# EAGLE design Board 1 (EAGLE 9.1.1)
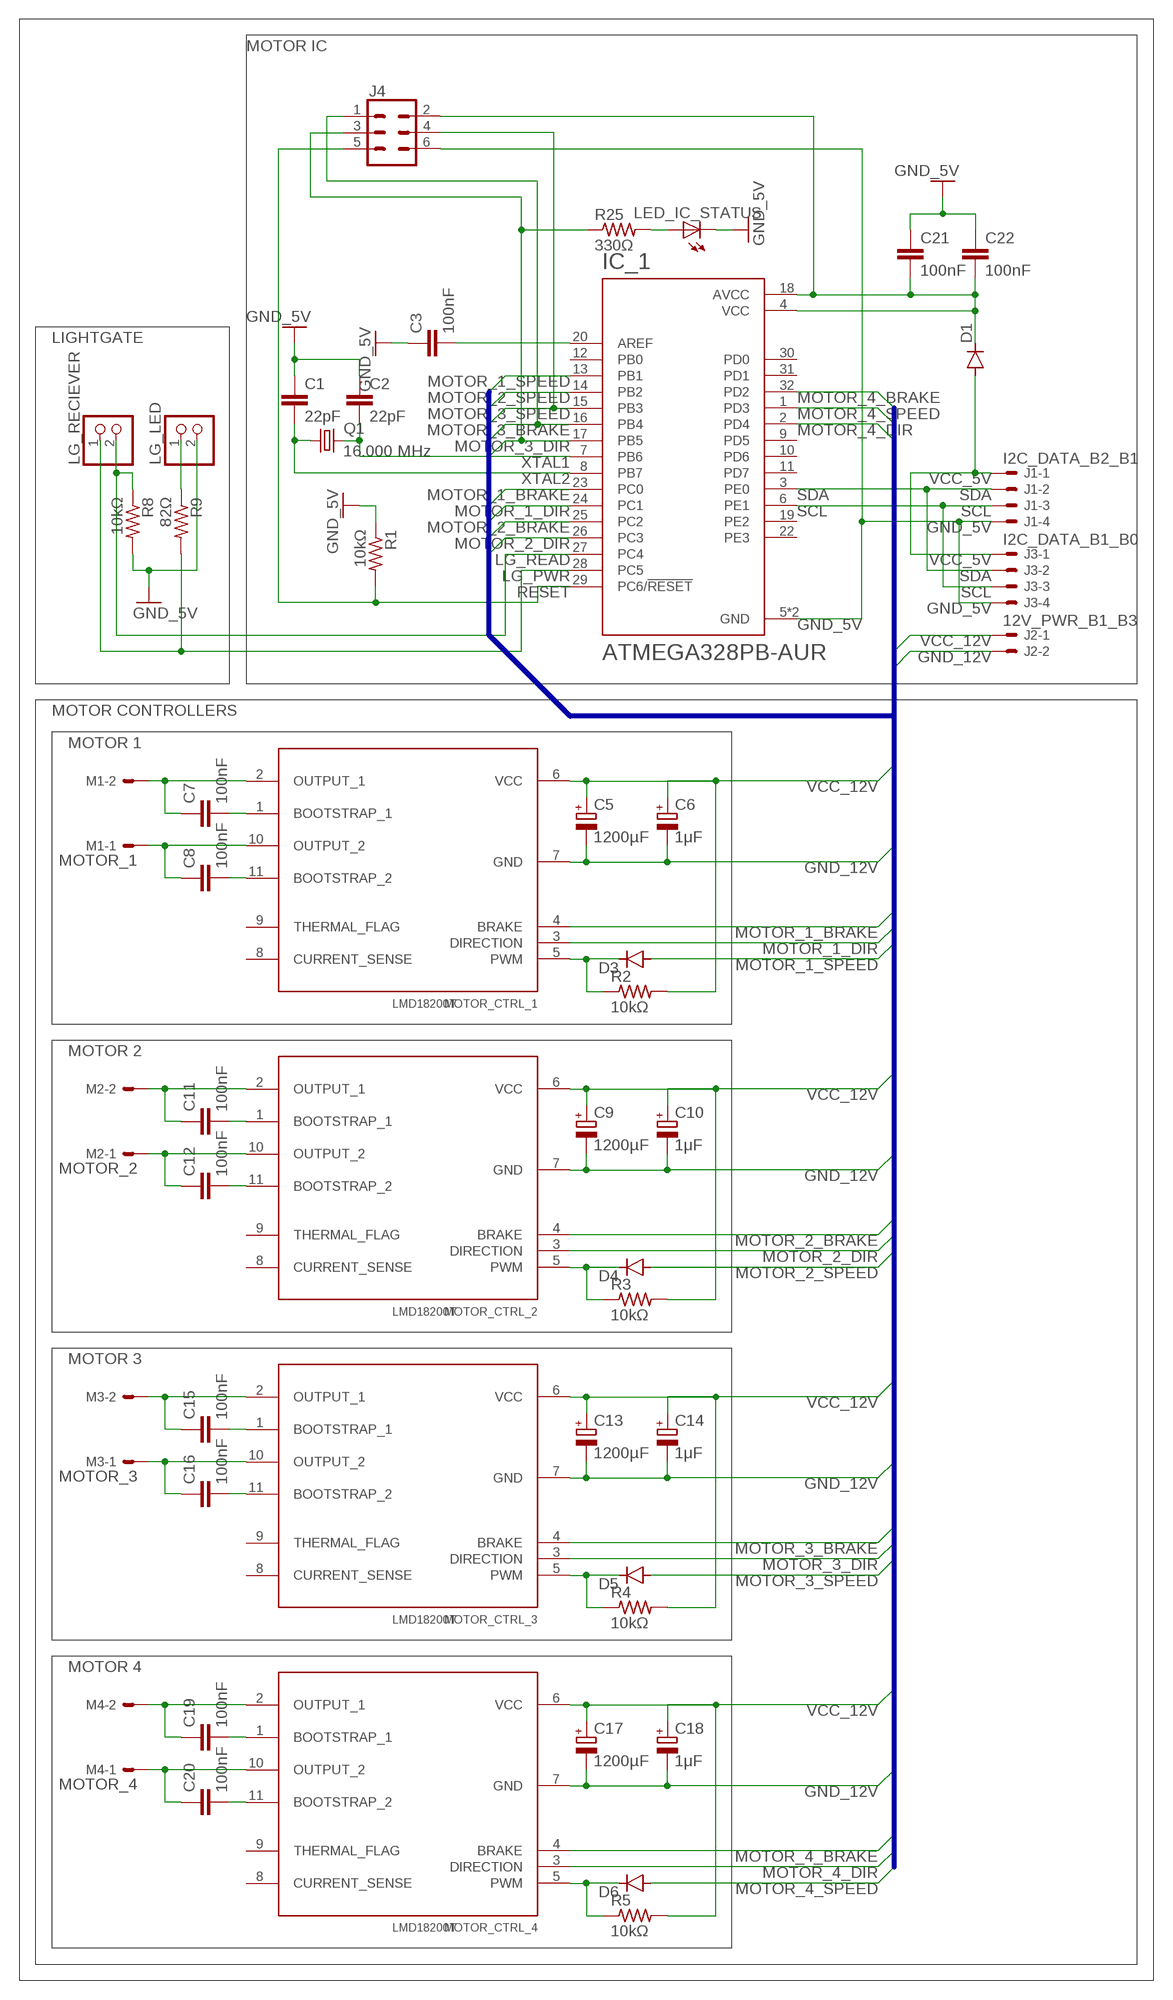
[diagram p0: schematic, sheet 1]

## Parts
C1  22pF  C-EU050-024X044  [C050-024X044]
C2  22pF  C-EU050-024X044  [C050-024X044]
C3  100nF  C-EU050-024X044  [C050-024X044]
C5  1200µF  CPOL-EUE5-13  [E5-13]
C6  1μF  CPOL-EUE2-5  [E2-5]
C7  100nF  C-EU050-024X044  [C050-024X044]
C8  100nF  C-EU050-024X044  [C050-024X044]
C9  1200µF  CPOL-EUE5-13  [E5-13]
C10  1μF  CPOL-EUE2-5  [E2-5]
C11  100nF  C-EU050-024X044  [C050-024X044]
C12  100nF  C-EU050-024X044  [C050-024X044]
C13  1200µF  CPOL-EUE5-13  [E5-13]
C14  1μF  CPOL-EUE2-5  [E2-5]
C15  100nF  C-EU050-024X044  [C050-024X044]
C16  100nF  C-EU050-024X044  [C050-024X044]
C17  1200µF  CPOL-EUE5-13  [E5-13]
C18  1μF  CPOL-EUE2-5  [E2-5]
C19  100nF  C-EU050-024X044  [C050-024X044]
C20  100nF  C-EU050-024X044  [C050-024X044]
C21  100nF  C-EU050-024X044  [C050-024X044]
C22  100nF  C-EU050-024X044  [C050-024X044]
D1  1N4148DO35-7  [DO35-7]
D3  1N4148DO35-7  [DO35-7]
D4  1N4148DO35-7  [DO35-7]
D5  1N4148DO35-7  [DO35-7]
D6  1N4148DO35-7  [DO35-7]
IC_1  ATMEGA328PB-AUR  [QFP80P900X900X120-32N]
J1  I2C_DATA_B2_B1  22-27-2041-04  [6410-04]
J2  12V_PWR_B1_B3  22-27-2021-02  [6410-02]
J3  I2C_DATA_B1_B0  22-27-2041-04  [6410-04]
J4  CONN_03X2SHROUD  [2X3-SHROUDED]
LED_IC_STATUS  LEDP-LCC-2  [P-LCC-2]
LG_LED  PINHD-1X2  [1X02]
LG_RECIEVER  PINHD-1X2  [1X02]
M1  MOTOR_1  22-27-2021-02  [6410-02]
M2  MOTOR_2  22-27-2021-02  [6410-02]
M3  MOTOR_3  22-27-2021-02  [6410-02]
M4  MOTOR_4  22-27-2021-02  [6410-02]
MOTOR_CTRL_1  LMD18200T  [TO-220-11]
MOTOR_CTRL_2  LMD18200T  [TO-220-11]
MOTOR_CTRL_3  LMD18200T  [TO-220-11]
MOTOR_CTRL_4  LMD18200T  [TO-220-11]
Q1  16.000 MHz  CRYSTALHC49U-V  [HC49U-V]
R1  10kΩ  R-US_0207/10  [0207/10]
R2  10kΩ  R-US_0207/10  [0207/10]
R3  10kΩ  R-US_0207/10  [0207/10]
R4  10kΩ  R-US_0207/10  [0207/10]
R5  10kΩ  R-US_0207/10  [0207/10]
R8  10kΩ  R-US_0207/10  [0207/10]
R9  82Ω  R-US_0207/10  [0207/10]
R25  330Ω  R-US_0207/10  [0207/10]

## Nets
GND_5V [+5V Power]: C1.1 C2.1 C3.1 C21.1 C22.1 IC_1.5(GND) IC_1.21(GND) J1.4 J3.4 J4.6 LED_IC_STATUS.C LG_LED.2 R1.1 R8.2
GND_12V [+12V Power]: C5.- C6.- C9.- C10.- C13.- C14.- C17.- C18.- J2.2 MOTOR_CTRL_1.7(GND) MOTOR_CTRL_2.7(GND) MOTOR_CTRL_3.7(GND) MOTOR_CTRL_4.7(GND)
LG_PWR: IC_1.28(PC5) LG_RECIEVER.1 R9.2
LG_READ: IC_1.27(PC4) LG_RECIEVER.2 R8.1
MOTOR_1_BRAKE: IC_1.23(PC0) MOTOR_CTRL_1.4(BRAKE)
MOTOR_1_DIR: IC_1.24(PC1) MOTOR_CTRL_1.3(DIRECTION)
MOTOR_1_SPEED: D3.A IC_1.13(PB1)
MOTOR_2_BRAKE: IC_1.25(PC2) MOTOR_CTRL_2.4(BRAKE)
MOTOR_2_DIR: IC_1.26(PC3) MOTOR_CTRL_2.3(DIRECTION)
MOTOR_2_SPEED: D4.A IC_1.14(PB2)
MOTOR_3_BRAKE: IC_1.16(PB4) J4.1 MOTOR_CTRL_3.4(BRAKE)
MOTOR_3_DIR: IC_1.17(PB5) J4.3 MOTOR_CTRL_3.3(DIRECTION) R25.1
MOTOR_3_SPEED: D5.A IC_1.15(PB3) J4.4
MOTOR_4_BRAKE: IC_1.32(PD2) MOTOR_CTRL_4.4(BRAKE)
MOTOR_4_DIR: IC_1.2(PD4) MOTOR_CTRL_4.3(DIRECTION)
MOTOR_4_SPEED: D6.A IC_1.1(PD3)
N$1: C3.2 IC_1.20(AREF)
N$4: LG_LED.1 R9.1
N$6: LED_IC_STATUS.A R25.2
N$8: D3.C MOTOR_CTRL_1.5(PWM) R2.1
N$10 [+5V Power]: C7.1 M1.2 MOTOR_CTRL_1.2(OUTPUT_1)
N$11 [+5V Power]: C21.2 C22.2 D1.C IC_1.4(VCC) IC_1.18(AVCC) J4.2
N$12 [+5V Power]: C8.1 M1.1 MOTOR_CTRL_1.10(OUTPUT_2)
N$13 [+5V Power]: C8.2 MOTOR_CTRL_1.11(BOOTSTRAP_2)
N$14 [+5V Power]: C7.2 MOTOR_CTRL_1.1(BOOTSTRAP_1)
N$17: D4.C MOTOR_CTRL_2.5(PWM) R3.1
N$18 [+5V Power]: C11.1 M2.2 MOTOR_CTRL_2.2(OUTPUT_1)
N$19 [+5V Power]: C12.1 M2.1 MOTOR_CTRL_2.10(OUTPUT_2)
N$20 [+5V Power]: C12.2 MOTOR_CTRL_2.11(BOOTSTRAP_2)
N$21: C11.2 MOTOR_CTRL_2.1(BOOTSTRAP_1)
N$24: D5.C MOTOR_CTRL_3.5(PWM) R4.1
N$25 [+5V Power]: C15.1 M3.2 MOTOR_CTRL_3.2(OUTPUT_1)
N$26 [+5V Power]: C16.1 M3.1 MOTOR_CTRL_3.10(OUTPUT_2)
N$27 [+5V Power]: C16.2 MOTOR_CTRL_3.11(BOOTSTRAP_2)
N$28 [+5V Power]: C15.2 MOTOR_CTRL_3.1(BOOTSTRAP_1)
N$31: D6.C MOTOR_CTRL_4.5(PWM) R5.1
N$32 [+5V Power]: C19.1 M4.2 MOTOR_CTRL_4.2(OUTPUT_1)
N$33 [+5V Power]: C20.1 M4.1 MOTOR_CTRL_4.10(OUTPUT_2)
N$34 [+5V Power]: C20.2 MOTOR_CTRL_4.11(BOOTSTRAP_2)
N$35 [+5V Power]: C19.2 MOTOR_CTRL_4.1(BOOTSTRAP_1)
RESET: IC_1.29(PC6/!RESET) J4.5 R1.2
SCL: IC_1.6(PE1) J1.3 J3.3
SDA: IC_1.3(PE0) J1.2 J3.2
VCC_5V [+5V Power]: D1.A J1.1 J3.1
VCC_12V [+12V Power]: C5.+ C6.+ C9.+ C10.+ C13.+ C14.+ C17.+ C18.+ J2.1 MOTOR_CTRL_1.6(VCC) MOTOR_CTRL_2.6(VCC) MOTOR_CTRL_3.6(VCC) MOTOR_CTRL_4.6(VCC) R2.2 R3.2 R4.2 R5.2
XTAL1: C2.2 IC_1.7(PB6) Q1.2
XTAL2: C1.2 IC_1.8(PB7) Q1.1
Unconnected: IC_1.9(PD5) IC_1.10(PD6) IC_1.11(PD7) IC_1.12(PB0) IC_1.19(PE2) IC_1.22(PE3) IC_1.30(PD0) IC_1.31(PD1) MOTOR_CTRL_1.8(CURRENT_SENSE) MOTOR_CTRL_1.9(THERMAL_FLAG) MOTOR_CTRL_2.8(CURRENT_SENSE) MOTOR_CTRL_2.9(THERMAL_FLAG) MOTOR_CTRL_3.8(CURRENT_SENSE) MOTOR_CTRL_3.9(THERMAL_FLAG) MOTOR_CTRL_4.8(CURRENT_SENSE) MOTOR_CTRL_4.9(THERMAL_FLAG)

## Buses
MOTOR:GND_12V,MOTOR_1_BRAKE,MOTOR_1_DIR,MOTOR_1_SPEED,MOTOR_2_BRAKE,MOTOR_2_DIR,MOTOR_2_SPEED,MOTOR_3_BRAKE,MOTOR_3_DIR,MOTOR_3_SPEED,MOTOR_4_BRAKE,MOTOR_4_DIR,MOTOR_4_SPEED,VCC_12V

## Notes on the sheet
- MOTOR IC
- LIGHTGATE
- MOTOR CONTROLLERS
- MOTOR 1
- MOTOR 2
- MOTOR 3
- MOTOR 4

## Library data of the parts
C1-C3 C7 C8 C11 C12 C15 C16 C19-C22 = rcl:C-EU: CAPACITOR, European symbol; SPICEPREFIX: C
C5 C6 C9 C10 C13 C14 C17 C18 = rcl:CPOL-EU: POLARIZED CAPACITOR, European symbol; SPICEPREFIX: C
D1 D3-D6 = diode:1N4148: DIODE high speed (Philips)
IC_1 = ATMEGA328PB-AUR:ATMEGA328PB-AUR: ATmega Series 20 MHz 32 KB Flash 2 KB SRAM 8-Bit Microcontroller - TQFP-32; AVAILABILITY: Unavailable; DESCRIPTION: AVR microcontroller; EEPROM: 1024B; SRAM: 2kB; Flash: 32kB; TQFP32; MF: Microchip; MP: ATMEGA328PB-AUR; PACKAGE: TQFP-32 Microchip; PRICE: None
J1 J3 = con-molex:22-?-04: CONNECTOR wire to board 2.54 mm (.1 inch) pitch header; MF: MOLEX; OC_FARNELL: unknown; OC_NEWARK: unknown
J2 M1-M4 = con-molex:22-?-02: CONNECTOR wire to board 2.54 mm (.1 inch) pitch header; MF: MOLEX; OC_FARNELL: unknown; OC_NEWARK: unknown
J4 = SparkFun-Connectors:CONN_03X2: Multi connection point. Often used as Generic Header-pin footprint for 0.1 inch spaced/style header connections You can populate with any combo of single row headers, but if you'd like an exact match, check these: Header - 2x3 (Male, 0.1") <https://www.sparkfun.com/products/12807> (PRT-12807) Header - 2x3 (Female, 0.1") <https://www.sparkfun.com/products/13010> (PRT-13010) 2x3 Pin Shrouded Header <https://www.sparkfun.com/products/10877> (PRT-10877) On any of the 0.1 inch spaced packages, you can populate with these: Break Away Headers - Straight <https://www.sparkfun.com/products/116> (PRT-00116) Break Away Male Headers - Right Angle <https://www.sparkfun.com/products/553> (PRT-00553) Female Headers <https://www.sparkfun.com/products/115> (PRT-00115) Break Away Headers - Machine Pin <https://www.sparkfun.com/products/117> (PRT-00117) Break Away Female Headers - Swiss Machine Pin <https://www.sparkfun.com/products/743> (PRT-00743) Special note: the shrouded connector mates well with our 3x2 ribbon cables: Ribbon Crimp Connector - 6-pin (2x3, Female) <https://www.sparkfun.com/products/10651> (PRT-10651) Ribbon Cable - 6 wire (15ft) <https://www.sparkfun.com/products/10646> (PRT-10646); PROD_ID: CONN-10681; SF_ID: PRT_10877
LED_IC_STATUS = adafruit:LED: LED OSRAM: - CHIPLED LG R971, LG N971, LY N971, LG Q971, LY Q971, LO R971, LY R971 LH N974, LH R974 LS Q976, LO Q976, LY Q976 LO Q996 - Hyper CHIPLED LW Q18S LB Q993, LB Q99A, LB R99A - SideLED LS A670, LO A670, LY A670, LG A670, LP A670 LB A673, LV A673, LT A673, LW A673 LH A674 LY A675 LS A676, LA A676, LO A676, LY A676, LW A676 LS A679, LY A679, LG A679 - Hyper Micro SIDELED® LS Y876, LA Y876, LO Y876, LY Y876 LT Y87S - SmartLED LW L88C, LW L88S LB L89C, LB L89S, LG L890 LS L89K, LO L89K, LY L89K LS L896, LA L896, LO L896, LY L896 - TOPLED LS T670, LO T670, LY T670, LG T670, LP T670 LSG T670, LSP T670, LSY T670, LOP T670, LYG T670 LG T671, LOG T671, LSG T671 LB T673, LV T673, LT T673, LW T673 LH T674 LS T676, LA T676, LO T676, LY T676, LB T676, LH T676, LSB T676, LW T676 LB T67C, LV T67C, LT T67C, LS T67K, LO T67K, LY T67K, LW E67C LS E67B, LA E67B, LO E67B, LY E67B, LB E67C, LV E67C, LT E67C LW T67C LS T679, LY T679, LG T679 LS T770, LO T770, LY T770, LG T770, LP T770 LB T773, LV T773, LT T773, LW T773 LH T774 LS E675, LA E675, LY E675, LS T675 LS T776, LA T776, LO T776, LY T776, LB T776 LHGB T686 LT T68C, LB T68C - Hyper Mini TOPLED® LB M676 - Mini TOPLED Santana® LG M470 LS M47K, LO M47K, LY M47K Source: http://www.osram.convergy.de/
LG_LED LG_RECIEVER = pinhead:PINHD-1X2: PIN HEADER
MOTOR_CTRL_1-MOTOR_CTRL_4 = lmd1820x:LMD18200: National Semiconductor LMD18200 3A, 55V H-Bridge
Q1 = crystal:CRYSTAL: CRYSTAL; OC_FARNELL: 1666969; OC_NEWARK: unknown
R1-R5 R8 R9 R25 = resistor:R-US_: RESISTOR, American symbol

## Net classes
1 +12V Power: width 2.032 mm, drill 1.397 mm, clearance 0.356 mm
2 +5V Power: width 0.508 mm, drill 0.61 mm, clearance 0.203 mm

## Board
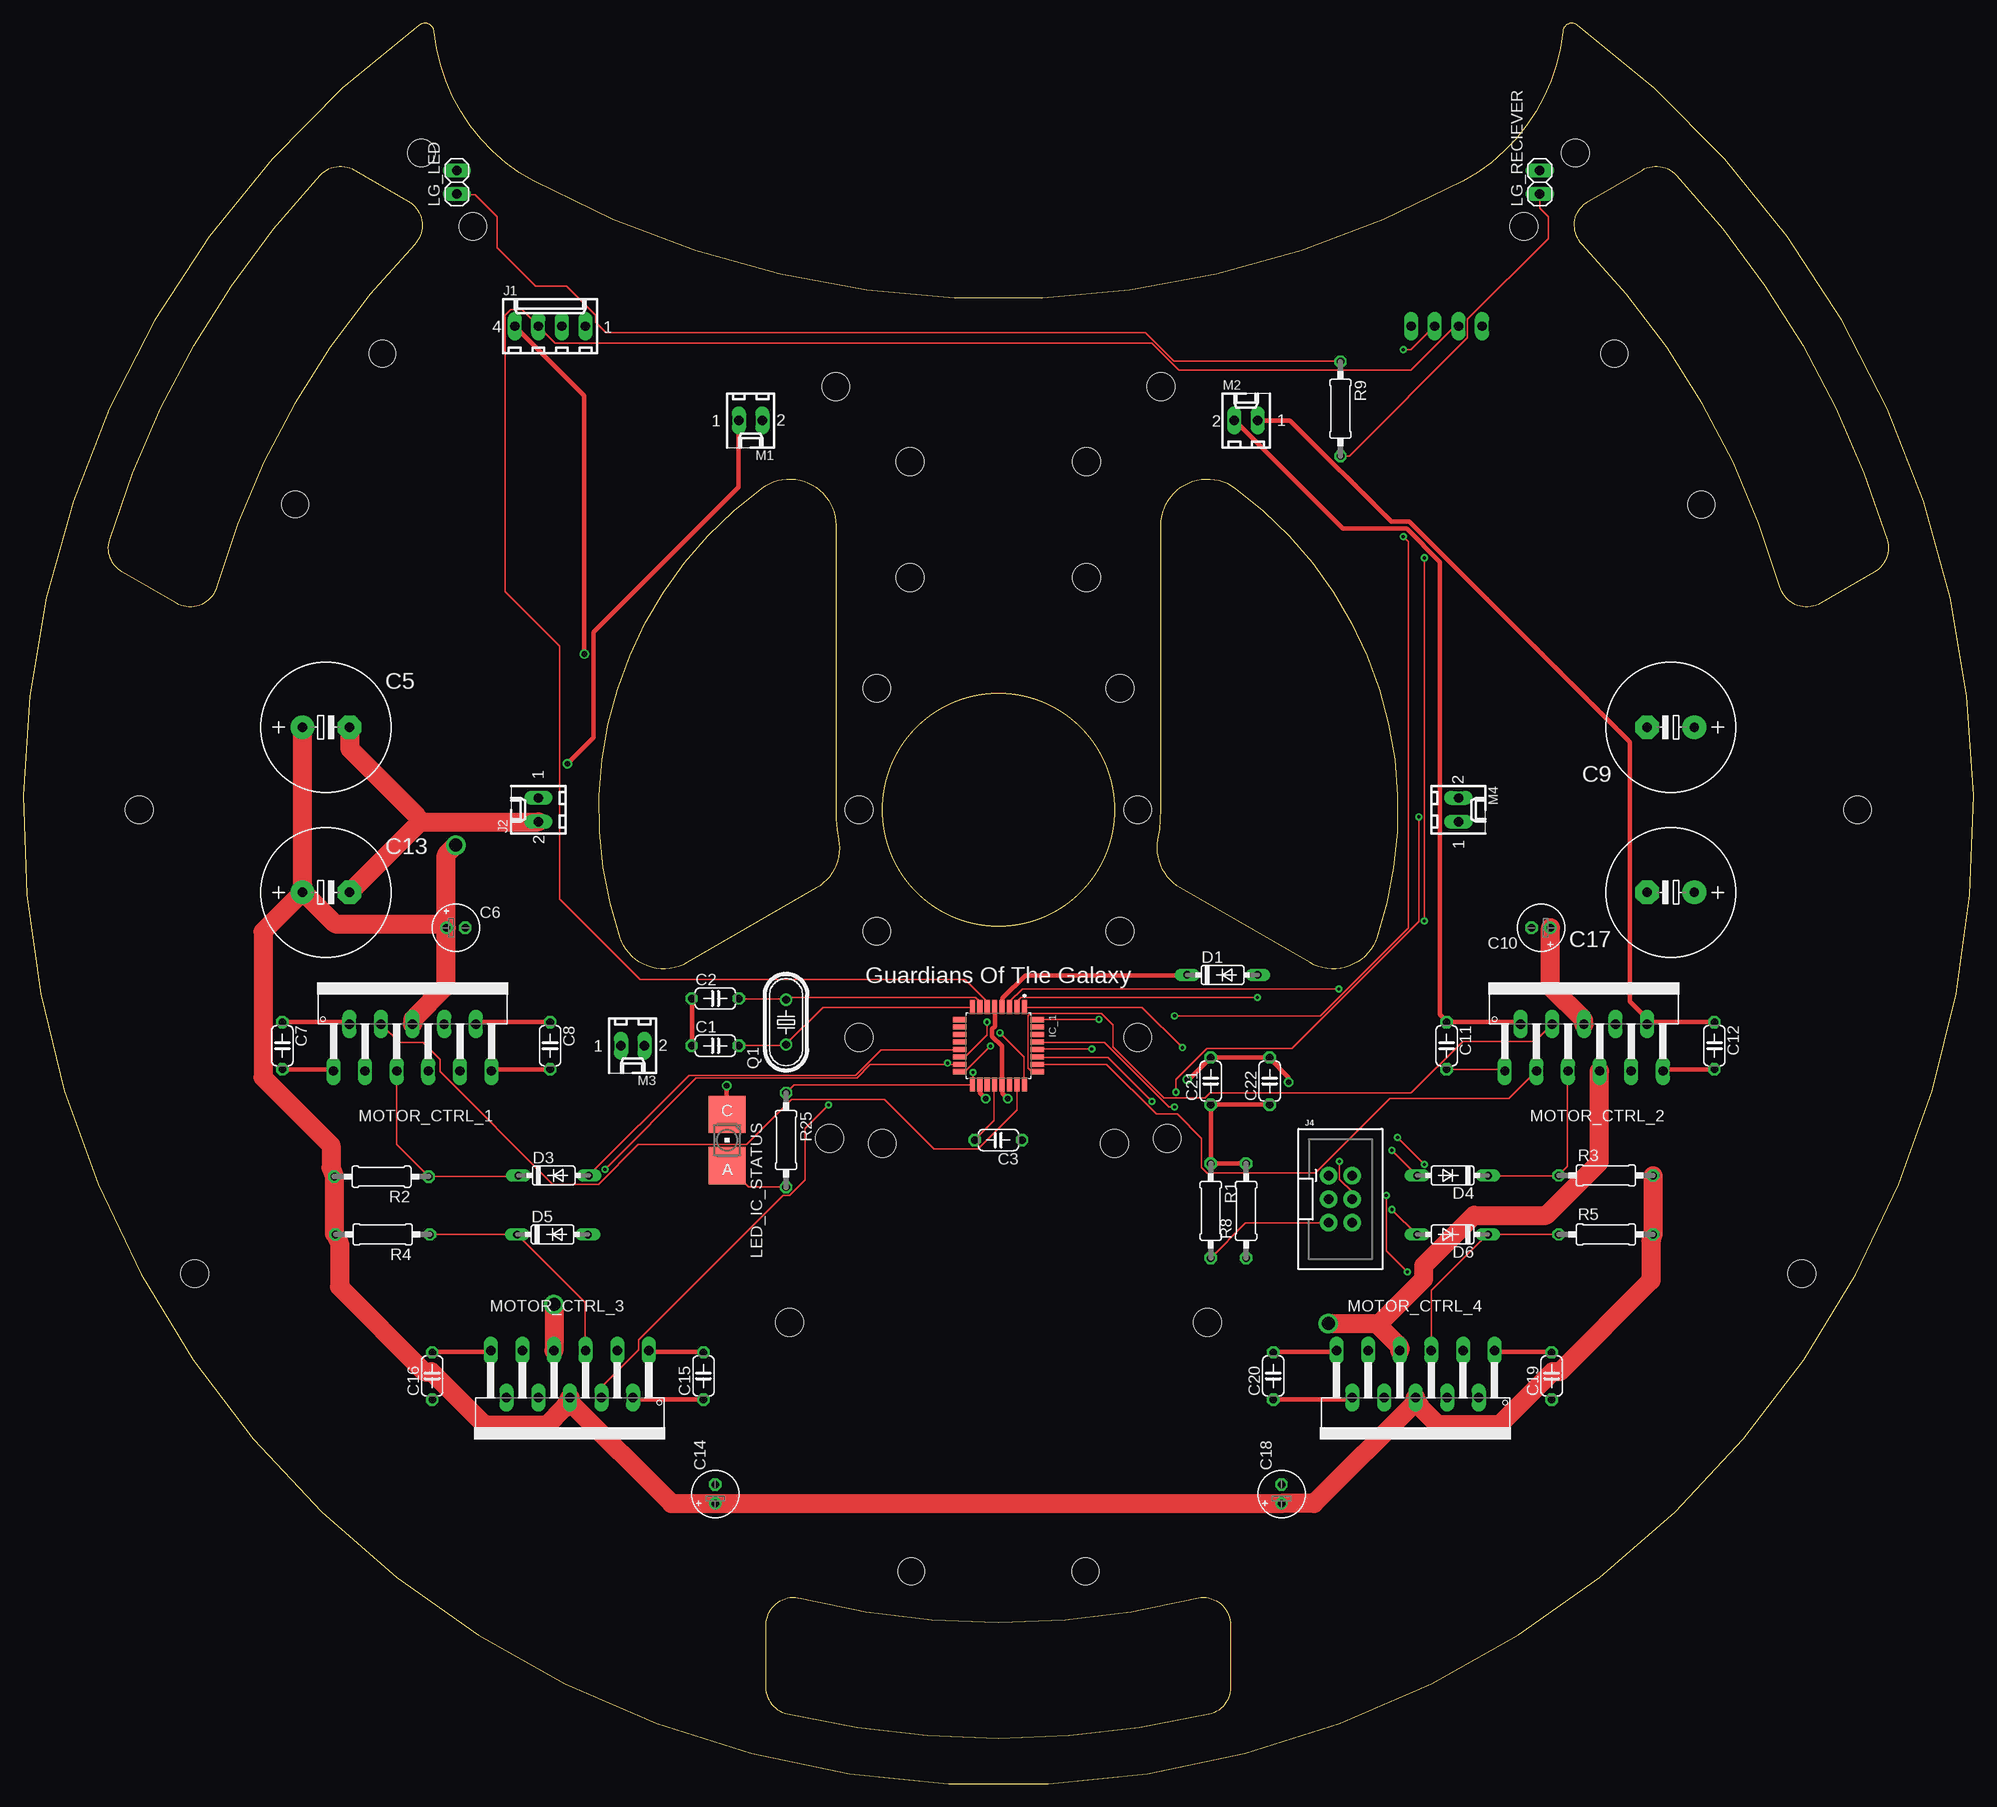
[diagram p1: board, top side]
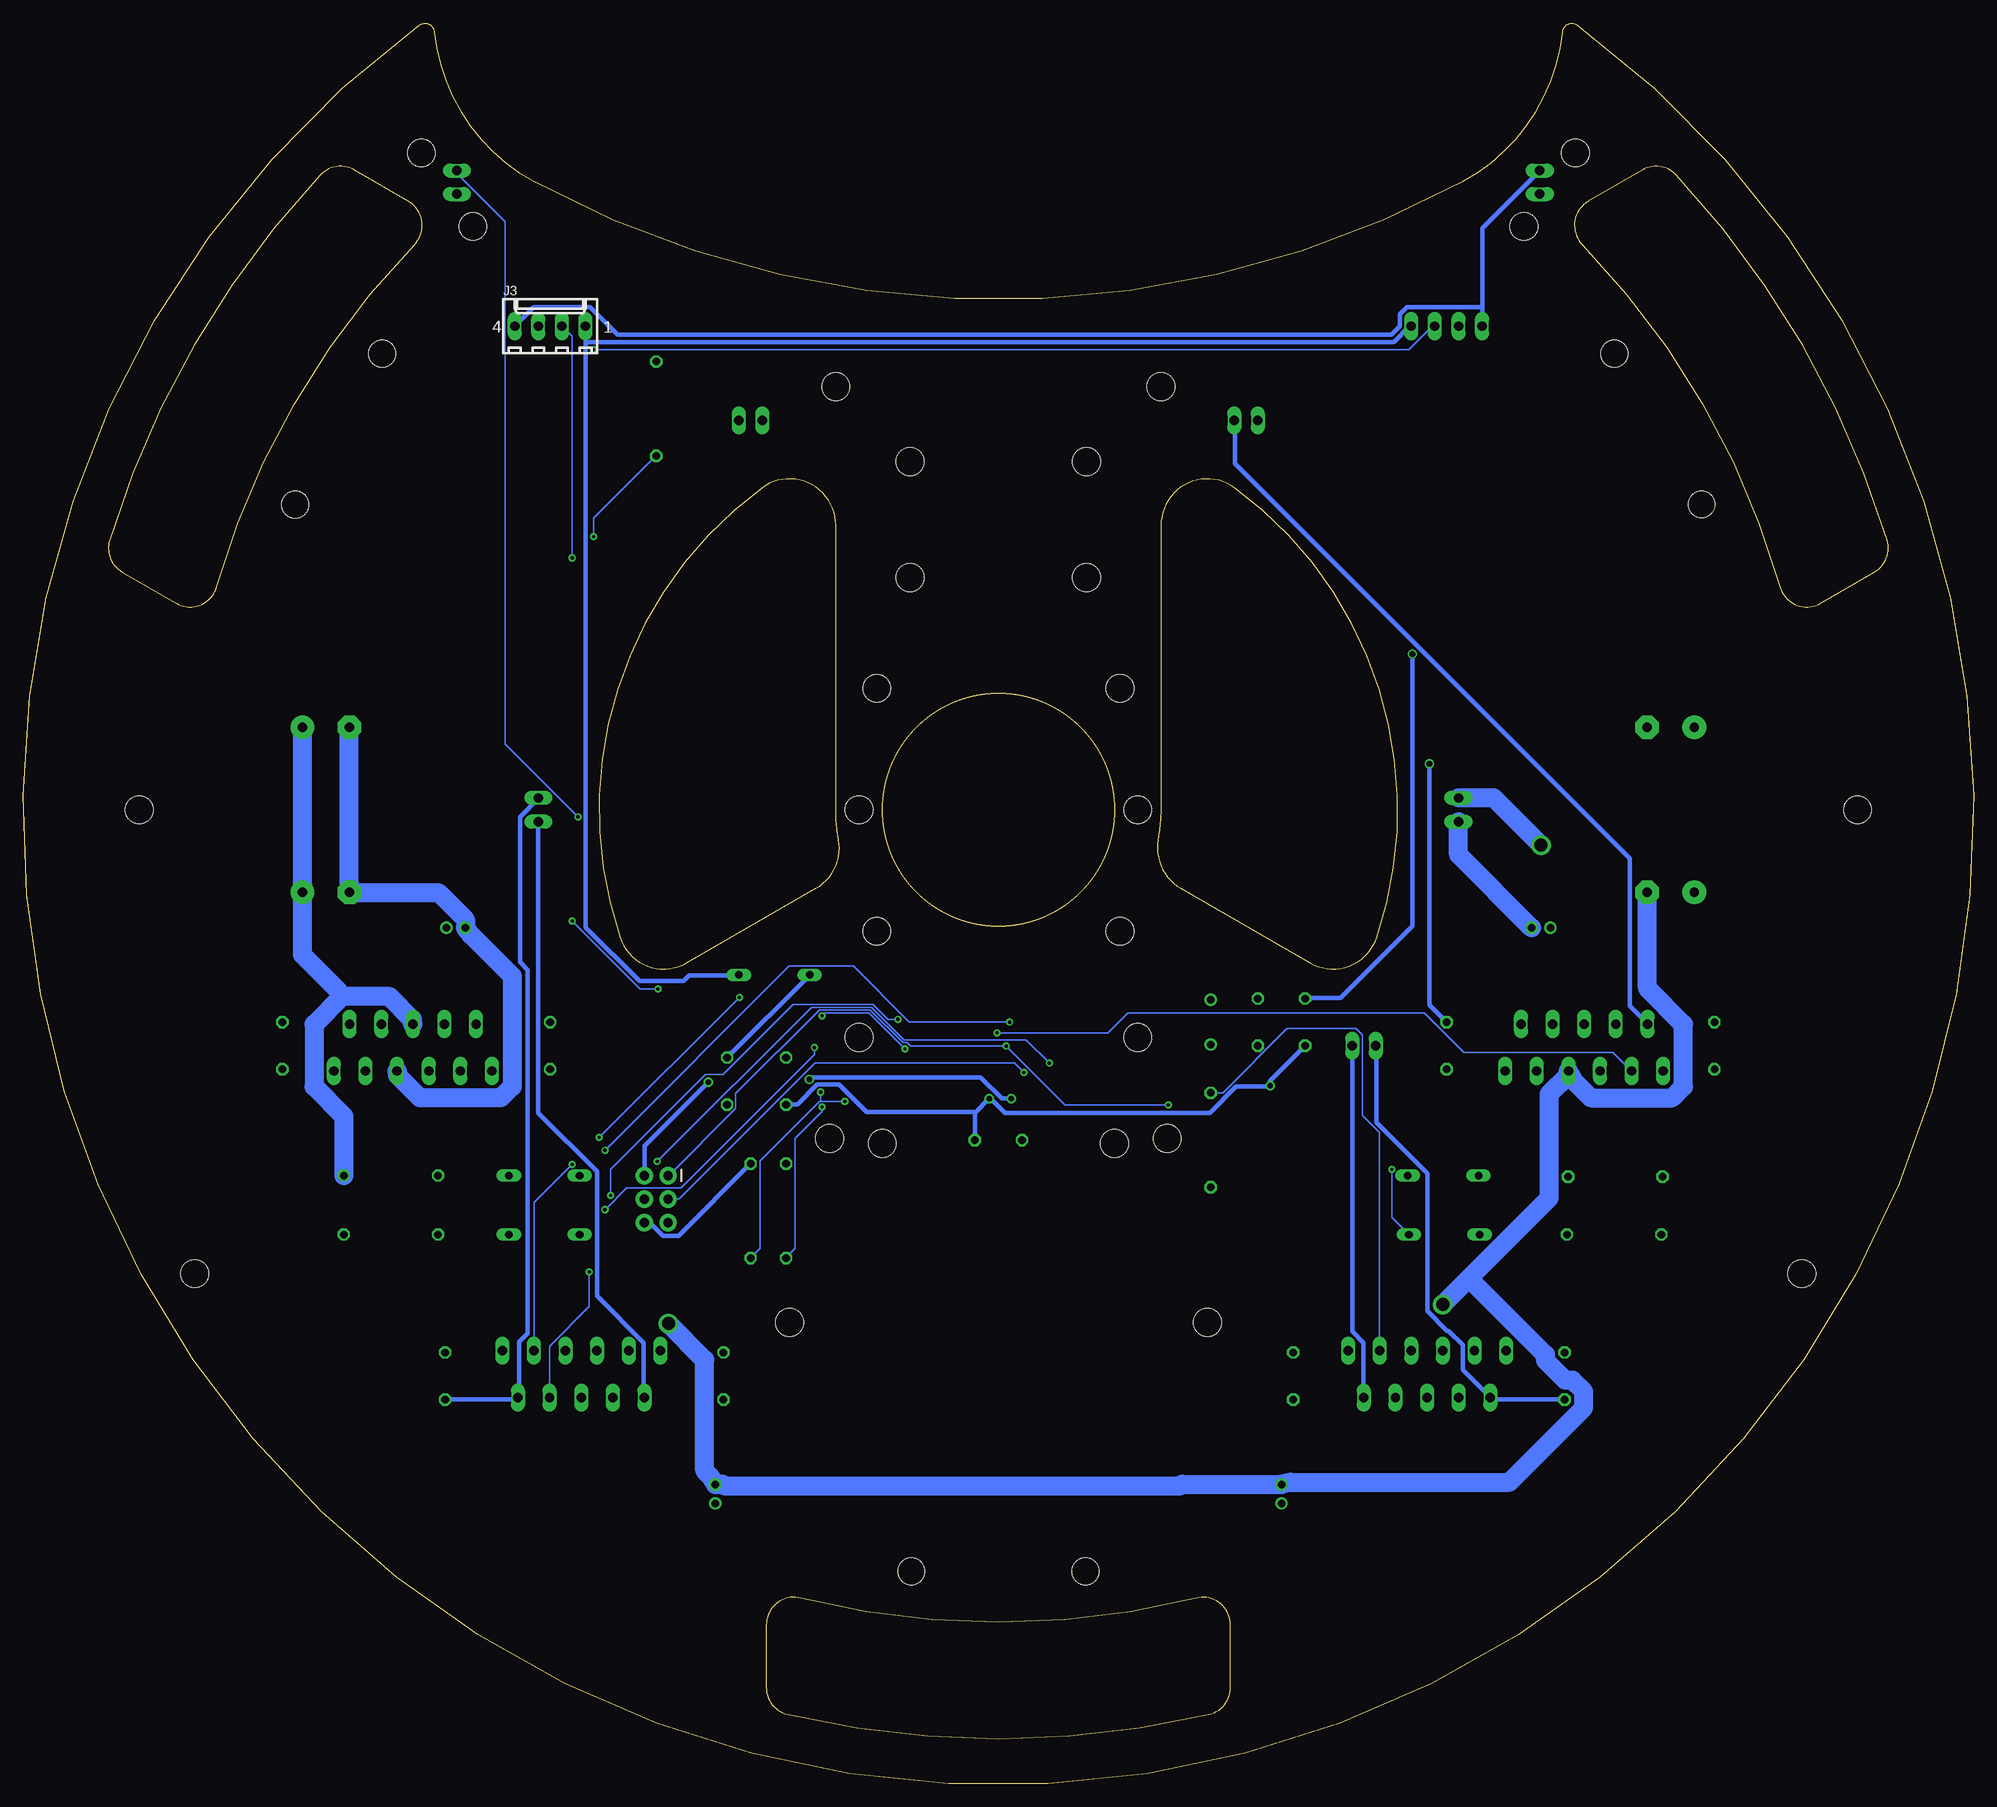
[diagram p2: board, bottom side, seen from below]

Size 209.98 x 189.55 mm. Coordinates in mm from the lower left corner, seen from the top.
Outline: 130.45,139.52 arc-72 145.74,91.13 arc-101 138.5,88.4 124.61,96.42 arc-71 122.2,101.66 arc11 122.49,104.86 122.49,135.49 arc-126 130.45,139.52
Outline: 85.37,96.42 71.48,88.4 arc-101 64.24,91.14 arc-72 79.53,139.52 arc-126 87.49,135.49 87.49,104.86 arc11 87.78,101.66 arc-71 85.37,96.42
Outline: 189.13,128.88 arc28 167.86,165.72 arc-104 168.51,170.4 174.3,173.75 arc-77 177.99,173.2 arc-26 200.68,133.92 arc-77 199.3,130.45 193.51,127.1 arc-104 189.13,128.88
Outline: 16.46,127.1 10.67,130.45 arc-77 9.3,133.92 arc-26 31.98,173.2 arc-77 35.67,173.75 41.46,170.4 arc-104 42.12,165.72 arc28 20.85,128.88 arc-104 16.46,127.1
Outline: 127.67,7.47 arc-26 82.31,7.47 arc-77 79.99,10.39 79.99,17.08 arc-104 83.72,19.99 arc28 126.26,19.99 arc-104 129.99,17.08 129.99,10.39 arc-77 127.67,7.47
Outline: 44.24,188.65 arc121 42.65,189.35 arc287 167.33,189.35 arc121 165.74,188.65 arc-56 154.99,172.53 arc-57 54.99,172.53 arc-56 44.24,188.65
Outline: circle at 104.99,104.86 radius 12.5
Copper layers (1*16): Top 0.035mm / dielectric 1.5mm / Bottom 0.035mm
Design rules "default": minimum track width 6mil, minimum drill 0.35mm, track to track 6mil, track to pad 6mil, pad to pad 6mil, via to via 6mil, smd to smd 6mil, copper to edge 40mil, drill to drill 6mil, minimum pad ring 10mil, minimum via ring 8mil, stop-mask expansion 4mil, vias tented up to drill 0mil, thermal gap 10mil
Holes 3 mm at 42.86,175.57 48.4,167.66 161.57,167.66 167.11,175.57 87.49,150.41 122.49,150.41 95.49,142.36 114.49,142.36 95.49,129.86 114.49,129.86 91.91,117.94 118.07,117.94 89.99,104.86 119.99,104.86 91.91,91.78 118.07,91.78 89.99,80.35 119.99,80.35 86.81,69.48 92.49,68.93 117.49,68.93 123.17,69.48 82.49,49.68 127.49,49.68 18.48,54.91 12.5,104.86 197.49,104.86 191.5,54.91
Holes 2.9 mm at 95.61,22.86 114.37,22.87 29.29,137.74 38.67,153.98 171.32,153.98 180.68,137.74
tRestrict: 44 lines
bRestrict: 44 lines

### Footprints (pad centres in the part's own frame; a part is rotated, then mirrored left to right if it is on the bottom)
C050-024X044 = drill 0.813 octagon: 1 -2.54,0; 2 2.54,0
E5-13 = drill 1.016 pad 2.54: + -2.54,0 | drill 1.016 pad 2.54 octagon: - 2.54,0
E2-5 = drill 0.813 pad 1.27: + -1.016,0 | drill 0.813 pad 1.27 octagon: - 1.016,0
DO35-7 = drill 0.813 long: A 3.81,0; C -3.81,0
QFP80P900X900X120-32N = smd 1.47 x 0.55: 1 -4.17,2.8; 2 -4.17,2; 3 -4.17,1.2; 4 -4.17,0.4; 5 -4.17,-0.4; 6 -4.17,-1.2; 7 -4.17,-2; 8 -4.17,-2.8; 17 4.17,-2.8; 18 4.17,-2; 19 4.17,-1.2; 20 4.17,-0.4; 21 4.17,0.4; 22 4.17,1.2; 23 4.17,2; 24 4.17,2.8 | smd 0.55 x 1.47: 9 -2.8,-4.17; 10 -2,-4.17; 11 -1.2,-4.17; 12 -0.4,-4.17; 13 0.4,-4.17; 14 1.2,-4.17; 15 2,-4.17; 16 2.8,-4.17; 25 2.8,4.17; 26 2,4.17; 27 1.2,4.17; 28 0.4,4.17; 29 -0.4,4.17; 30 -1.2,4.17; 31 -2,4.17; 32 -2.8,4.17
6410-04 = drill 1.016 long: 1 3.81,0; 2 1.27,0; 3 -1.27,0; 4 -3.81,0
6410-02 = drill 1.016 long: 1 1.27,0; 2 -1.27,0
2X3-SHROUDED = drill 1.016 pad 1.88: 1 -1.27,2.54; 2 1.27,2.54; 3 -1.27,0; 4 1.27,0; 5 -1.27,-2.54; 6 1.27,-2.54
P-LCC-2 = smd 4 x 4: A 0,2.75; C 0,-2.75
1X02 = drill 1.016 long: 1 -1.27,0; 2 1.27,0
TO-220-11 = drill 1.016 long: 1 -8.084,-2.718; 2 -6.382,2.337; 3 -4.68,-2.718; 4 -2.978,2.337; 5 -1.276,-2.718; 6 0.425,2.337; 7 2.127,-2.718; 8 3.829,2.337; 9 5.531,-2.718; 10 7.233,2.337; 11 8.934,-2.718
HC49U-V = drill 0.813: 1 -2.413,0; 2 2.413,0
0207/10 = drill 0.813 octagon: 1 -5.08,0; 2 5.08,0

### Placement (x,y rotation side)
C1  74.51,79.46 0 top
C2  74.51,84.54 0 top
C3  104.99,69.3 180 top
C5  32.6,113.75 0 top
C6  46.57,92.16 0 top
C7  27.9,79.46 270 top
C8  56.73,79.46 270 top
C9  177.38,113.75 180 top
C10  163.41,92.16 180 top
C11  153.25,79.46 270 top
C12  182.08,79.46 270 top
C13  32.6,95.97 0 top
C14  74.51,31.2 90 top
C15  73.24,43.9 90 top
C16  44.03,43.9 90 top
C17  177.38,95.97 180 top
C18  135.47,31.2 90 top
C19  164.55,43.9 90 top
C20  134.58,43.9 90 top
C21  127.85,75.65 90 top
C22  134.2,75.65 90 top
D1  129.12,87.08 0 top
D3  57.11,65.49 0 top
D4  153.88,65.49 180 top
D5  56.98,59.14 0 top
D6  153.88,59.14 180 top
IC_1  104.99,79.46 270 top
J1  56.73,156.93 0 top
J2  55.46,104.86 90 top
J3  153.25,156.93 0 bottom
J4  141.82,62.95 0 top
LED_IC_STATUS  75.78,69.3 180 top
LG_LED  46.7,172.42 90 top
LG_RECIEVER  163.28,172.42 90 top
M1  78.32,146.77 180 top
M2  131.66,146.77 0 top
M3  65.62,79.46 180 top
M4  154.52,104.86 270 top
MOTOR_CTRL_1  41.49,79.46 0 top
MOTOR_CTRL_2  167.6,79.46 0 top
MOTOR_CTRL_3  59.27,43.9 180 top
MOTOR_CTRL_4  150.33,43.9 180 top
Q1  82.13,82 90 top
R1  127.85,61.68 270 top
R2  38.57,65.36 180 top
R3  170.39,65.49 0 top
R4  38.69,59.14 180 top
R5  170.39,59.14 0 top
R8  131.66,61.68 90 top
R9  141.82,148.04 270 top
R25  82.13,69.3 270 top

### Tracks (layer width: path | path; a pad name or v marks a point on that pad's centre or on a via)
GND_5V  (via drill 0.61)
  Top 0.508: C1.1 71.99,79.49 71.99,84.52 C2.1 | v75.73,75.14 75.73,72.1 LED_IC_STATUS.C | IC_1.5 104.61,83.6 104.61,81.54 104.3,81.24 104.3,80.48 105.37,79.41 105.37,75.3 IC_1.21 105.45,75.07 105.45,74.31 v105.98,73.77 | R8.2 R1.1 C21.1 128.08,73.16 134.17,73.16 C22.1 | v60.41,121.63 60.41,149.44 J1.4
  Bottom 0.508: C1.1 71.99,79.41 75.73,75.68 v75.73,75.14 75.96,75.07 79.39,75.07 82.2,72.25 104.3,72.25 105.75,73.7 v105.98,73.77 107.5,72.25 | 107.5,72.25 107.5,69.35 C3.1 | R8.2 139.43,58.99 141.11,58.99 142.48,60.36 143.09,60.36 J4.6 | 107.5,72.25 107.73,72.32 119.16,72.32 122.13,75.3 124.5,75.3 126.63,73.16 127.85,73.16 C21.1 | 52.87,158.96 52.87,167.5 46.7,173.67 LG_LED.2 | 52.87,158.96 52.87,156.98 J1.4 | 52.87,158.96 61.02,158.96 61.78,158.2 61.78,156.91 62.7,155.99 145.98,155.99 148.96,158.96 155.05,158.96 157.03,156.98 J3.4 | v60.41,121.63 60.41,92.36 68.18,84.59 71.92,84.59 C2.1
GND_12V  (via drill 1.4)
  Top 2.032: 42.73,103.57 55.46,103.57 J2.2 | C13.- 42.73,103.57 | C5.- 35.19,113.7 35.19,111.41 42.2,104.4 42.73,103.57 | v57.13,51.6 57.13,46.64 MOTOR_CTRL_3.7 | 145.83,49.39 145.68,49.54 v140.5,49.54 | 145.83,49.39 148.19,47.03 148.19,46.64 MOTOR_CTRL_4.7 | 145.83,49.39 150.78,54.34 150.78,55.79 156.19,61.2 163.97,61.2 169.68,66.91 169.68,76.74 MOTOR_CTRL_2.7
  Bottom 2.032: 54.32,54.42 45.7,63.03 45.7,74.23 43.65,76.29 43.65,76.74 MOTOR_CTRL_1.7 42.96,75.6 41.21,73.85 32.45,73.85 31.23,75.07 31.23,81.77 35.11,85.66 35.11,95.95 C13.- | 54.32,54.42 v57.13,51.6 | MOTOR_CTRL_2.7 169.68,76.74 169.68,76.29 167.24,73.85 158.56,73.85 157.34,75.07 157.34,86.95 161.76,91.37 C10.- 162.37,92.21 162.37,93.05 165.26,95.95 174.79,95.95 C17.- 174.86,96.94 174.86,113.7 C9.- | 74.51,32.24 85.18,32.24 85.33,32.09 134.55,32.09 134.71,32.24 135.47,32.24 | 74.51,32.24 C14.- | 135.47,32.24 C18.- | v140.5,49.54 136.61,45.65 136.61,33.69 136,33.08 135.47,32.24 | 54.32,54.42 46.09,46.19 46.09,45.58 43.95,43.44 43.19,43.44 41.97,42.23 41.97,40.47 49.97,32.47 73.52,32.47 74.51,32.24 | C6.- 55.46,100.04 J2.2
LG_PWR  (via drill 0.35)
  Top 0.152: v115.05,79.11 109.18,79.11 IC_1.28 | v123.96,82.69 139.66,82.69 149.11,92.14 149.11,133.74 v148.57,134.27 | LG_RECIEVER.1 163.28,169.63 164.2,168.72 164.2,166.35 155.51,157.67 155.51,155.69 142.78,142.96 R9.2
  Bottom 0.152: v115.05,79.11 118.93,82.99 123.66,82.99 v123.96,82.69 | v148.57,134.27 148.57,136.26 141.87,142.96 R9.2
LG_READ  (via drill 0.35)
  Top 0.152: v121.52,73.47 116.8,78.19 109.18,78.19 IC_1.27 | v150.25,104.1 150.25,92.82 136.61,79.18 127.47,79.18 124.11,75.83 v124.11,74.46
  Bottom 0.152: 124.11,73.47 124.27,73.47 130.67,67.07 130.67,57.62 131.66,56.63 R8.1 | 124.11,73.47 v121.52,73.47 | LG_RECIEVER.2 163.28,173.37 158.1,168.18 158.1,111.95 v150.25,104.1 | 124.11,73.47 v124.11,74.46
MOTOR_1_BRAKE
  Top 0.152: IC_1.23 106.97,75.22 106.97,72.55 102.78,68.36 98.05,68.36 92.72,73.7 82.74,73.7 77.86,68.82 66.2,68.82 61.94,64.55 56.98,64.55 44.87,76.67 44.87,77.96 43.04,79.79 40.52,79.79 38.54,81.77 MOTOR_CTRL_1.4
MOTOR_1_DIR  (via drill 0.35)
  Top 0.152: v105.14,80.86 107.73,78.27 107.73,75.3 IC_1.24
  Bottom 0.152: v105.14,80.86 93.18,80.86 91.04,82.99 59.12,82.99 54.85,78.72 38.85,78.72 36.87,76.74 MOTOR_CTRL_1.3
MOTOR_1_SPEED
  Top 0.152: IC_1.13 100.8,79.03 92.34,79.03 89.6,76.29 71.69,76.29 60.94,65.54 D3.A
MOTOR_2_BRAKE
  Top 0.152: IC_1.25 109.1,76.67 108.57,76.67 108.19,77.05 108.19,82.69 108.42,82.92 116.11,82.92 117.33,81.7 117.33,79.33 122.82,73.85 127.24,73.85 127.77,74.38 149.41,74.38 154.98,79.94 162.75,79.94 164.58,81.77 MOTOR_CTRL_2.4
MOTOR_2_DIR
  Top 0.152: IC_1.26 109.18,77.43 116.65,77.43 121.98,72.1 124.27,72.1 126.86,69.5 126.86,66.38 127.47,65.77 139.13,65.77 147.13,73.77 159.93,73.77 162.9,76.74 MOTOR_CTRL_2.3
MOTOR_2_SPEED  (via drill 0.35)
  Top 0.152: v103.77,82 103.77,80.63 101.41,78.27 100.87,78.27 IC_1.14 | D4.A v147.36,68.21
  Bottom 0.152: v103.77,82 114.59,82 120.61,88.02 127.54,88.02 v147.36,68.21
MOTOR_3_BRAKE  (via drill 0.35)
  Top 0.152: v104.15,79.41 101.41,76.67 100.87,76.67 IC_1.16 | v86.7,73.09 84.19,70.57 84.19,65.01 82.51,63.33 81.82,63.33 66.28,47.79 66.28,46.72 62.32,42.76 62.32,41.62 MOTOR_CTRL_3.4
  Bottom 0.152: J4.1 140.5,65.47 133.26,72.71 133.26,74.31 124.27,83.3 118.78,83.3 115.28,79.79 114.82,79.79 114.44,79.41 v104.15,79.41 97.83,73.09 v86.7,73.09
MOTOR_3_DIR  (via drill 0.35)
  Top 0.152: R25.1 82.97,75.22 102.17,75.22 IC_1.17 102.25,75.3 v102.25,76.59
  Bottom 0.152: R25.1 80.83,74.38 73.9,81.32 66.51,81.32 65.82,80.63 65.82,71.94 63.99,70.11 63.99,46.64 MOTOR_CTRL_3.3 | J4.3 139.35,62.95 124.72,77.58 103.24,77.58 v102.25,76.59
MOTOR_3_SPEED  (via drill 0.35)
  Top 0.152: 99.5,77.43 91.2,77.43 89.75,75.98 72.45,75.98 v62.62,66.15 | 99.5,77.43 100.8,77.43 IC_1.15 | J4.4 143.09,63.71 141.72,65.09 v141.72,66.99 | 99.5,77.43 v99.5,77.58
  Bottom 0.152: v62.62,66.15 62.62,60.97 D5.A | v141.72,66.99 125.11,83.6 118.63,83.6 115.12,80.1 102.02,80.1 v99.5,77.58
MOTOR_4_BRAKE  (via drill 0.35)
  Top 0.152: v115.81,82.31 109.18,82.31 IC_1.32 | v146.75,63.33 146.75,57.39 v149.03,55.1
  Bottom 0.152: v115.81,82.31 116.88,82.31 118.48,83.91 127.09,83.91 134.63,76.36 136.54,76.36 146.75,66.15 v146.75,63.33 | v149.03,55.1 149.03,51.37 153.3,47.1 153.3,41.62 MOTOR_CTRL_4.4
MOTOR_4_DIR  (via drill 0.35)
  Top 0.152: v132.88,84.67 107.43,84.67 107.05,84.29 107.05,83.68 IC_1.2 | v150.86,66.69 v147.97,69.58
  Bottom 0.152: v147.97,69.58 v132.88,84.67 | v150.86,66.69 154.98,62.57 154.98,46.64 MOTOR_CTRL_4.3
MOTOR_4_SPEED  (via drill 0.35)
  Top 0.152: v124.8,79.26 120.46,83.6 107.81,83.6 IC_1.1 | v147.36,61.81 150.02,59.14 D6.A
  Bottom 0.152: v124.8,79.26 124.8,78.5 139.13,64.17 144.99,64.17 v147.36,61.81
N$1
  Top 0.152: IC_1.20 104.53,75.22 104.53,71.41 102.47,69.35 C3.2
N$4
  Top 0.152: R9.1 141.79,153.17 123.89,153.17 120.84,156.22 62.77,156.22 61.63,157.36 61.63,158.13 58.51,161.25 55.15,161.25 51.04,165.36 51.04,168.72 48.68,171.08 46.7,171.08 LG_LED.1
N$6
  Top 0.152: R25.2 82.13,64.25 78.09,64.25 75.8,66.53 LED_IC_STATUS.A
N$8
  Top 0.152: 43.65,65.39 53.17,65.39 53.25,65.47 D3.C | 43.65,65.39 40.22,68.82 MOTOR_CTRL_1.5 | 43.65,65.39 R2.1
N$10
  Top 0.508: C7.1 34.88,82 35.04,81.85 MOTOR_CTRL_1.2
  Bottom 0.508: M1.2 79.54,146.77 79.54,142.12 37.02,99.6 37.02,83.75 35.11,81.85 MOTOR_CTRL_1.2
N$11  (via drill 0.61)
  Top 0.508: IC_1.4 105.45,83.68 105.45,84.59 107.88,87.03 125.26,87.03 D1.C | v103.62,73.77 103.01,74.38 103.01,75.22 IC_1.18 | v125.33,75.83 125.49,75.83 C21.2 C22.2 134.33,77.96 136.23,76.06 v136.23,75.52
  Bottom 0.508: v103.62,73.77 104.61,73.77 106.89,76.06 125.11,76.06 v125.33,75.83 | J4.2 143.09,68.67 v136.23,75.52 | D1.C 125.33,87.03 134.17,78.19 C22.2
N$12  (via drill 0.61)
  Top 0.508: C8.1 48.91,82 48.75,81.85 MOTOR_CTRL_1.10 | v58.58,109.81 61.4,112.63 61.4,123.99 77.02,139.61 77.02,146.77 M1.1
  Bottom 0.508: v58.58,109.81 58.58,83.83 56.75,82 C8.1
N$13
  Top 0.508: C8.2 56.68,76.9 50.58,76.9 50.43,76.74 MOTOR_CTRL_1.11
N$14
  Top 0.508: C7.2 27.95,76.9 33.21,76.9 33.36,76.74 MOTOR_CTRL_1.1
N$17
  Top 0.152: D4.C 157.72,65.47 165.26,65.47 R3.1 165.34,65.54 166.25,66.46 166.25,76.74 MOTOR_CTRL_2.5
N$18
  Top 0.508: MOTOR_CTRL_2.2 161.15,81.85 161,82 C11.1 153.15,82.23 152.54,82.84 152.54,131.53 148.96,135.11 142.1,135.11 130.44,146.77 M2.2
N$19
  Top 0.508: C12.1 175.02,82 174.86,81.85 MOTOR_CTRL_2.10 174.94,82.23 172.96,84.21 172.96,112.18 149.26,135.87 147.28,135.87 136.38,146.77 M2.1
N$20
  Top 0.508: C12.2 182.03,76.9 176.69,76.9 MOTOR_CTRL_2.11
N$21
  Top 0.152: C11.2 153.3,76.9 159.32,76.9 159.47,76.74 MOTOR_CTRL_2.1
N$24
  Top 0.152: R4.1 D5.C 60.49,51.83 60.49,46.64 MOTOR_CTRL_3.5
N$25
  Top 0.508: C15.1 73.21,41.39 65.82,41.39 65.67,41.54 MOTOR_CTRL_3.2
  Bottom 0.508: M3.2 66.89,48.7 65.67,47.48 65.67,41.62 MOTOR_CTRL_3.2
N$26
  Bottom 0.508: C16.1 44.03,41.39 51.88,41.39 52.03,41.54 MOTOR_CTRL_3.10 52.18,41.77 55,44.59 55,47.25 56.53,48.78 56.68,48.78 58.81,50.91 58.81,65.69 64.3,71.18 64.3,79.41 M3.1
N$27
  Top 0.508: C16.2 44.03,46.49 50.2,46.49 50.28,46.57 MOTOR_CTRL_3.11
N$28
  Top 0.508: C15.2 73.21,46.49 67.5,46.49 67.42,46.57 MOTOR_CTRL_3.1
N$31
  Top 0.152: R5.1 D6.C 157.64,59.14 151.62,53.12 151.62,46.64 MOTOR_CTRL_4.5
N$32
  Bottom 0.508: C19.1 164.5,41.39 156.88,41.39 156.73,41.54 MOTOR_CTRL_4.2 156.58,41.77 156.58,47.56 155.66,48.47 155.66,87.64 156.5,88.48 156.5,104.1 154.52,106.08 M4.2
N$33
  Top 0.508: C20.1 134.63,41.39 142.94,41.39 143.09,41.54 MOTOR_CTRL_4.10
  Bottom 0.508: M4.1 154.52,72.25 148.19,65.92 148.19,52.51 143.16,47.48 143.16,41.62 MOTOR_CTRL_4.10
N$34
  Top 0.508: C20.2 134.63,46.49 141.26,46.49 141.34,46.57 MOTOR_CTRL_4.11
N$35
  Top 0.508: C19.2 164.5,46.49 158.56,46.49 158.48,46.57 MOTOR_CTRL_4.1
RESET  (via drill 0.35)
  Top 0.152: v123.96,72.86 123.35,72.86 116.42,79.79 109.18,79.79 IC_1.29 | J4.5 140.5,60.36 131.58,60.36 127.85,56.63 R1.2
  Bottom 0.152: v123.96,72.86 123.96,72.4 126.86,69.5 126.86,57.62 127.85,56.63 R1.2
SCL
  Top 0.152: IC_1.6 103.77,83.68 103.77,84.21 101.41,86.57 66.43,86.57 57.74,95.26 57.74,122.46 51.88,128.33 51.88,158.13 52.49,158.73 53.71,158.73 55.46,156.98 J1.3 55.46,156.91 57.29,155.08 121.52,155.08 124.42,152.18 149.41,152.18 154.14,156.91 154.52,156.91 J3.3
SDA  (via drill 0.35)
  Top 0.152: v141.64,85.58 107.58,85.58 106.21,84.21 106.21,83.68 IC_1.3 | v150.86,131.99 v150.86,92.9 | v148.57,154.39 149.41,154.39 151.93,156.91 J3.2
  Bottom 0.152: v141.64,85.58 143.55,85.58 v150.86,92.9 | v150.86,131.99 150.86,155.84 151.93,156.91 J3.2 | v148.57,154.39 60.79,154.39 58.28,156.91 58.05,156.91 J1.2
VCC_5V
  Bottom 0.508: 149.41,155.23 149.41,156.91 J3.1 | 149.41,155.23 149.41,92.21 143.62,86.42 138.9,86.42 138.29,87.03 132.95,87.03 D1.A | 149.41,155.23 62.39,155.23 60.72,156.91 60.56,156.91 J1.1
VCC_12V  (via drill 1.4)
  Top 2.032: R3.2 R5.2 175.24,58.15 175.24,54.19 165.42,44.36 164.65,44.36 158.94,38.64 152.31,38.64 150.56,40.4 MOTOR_CTRL_4.6 149.87,41.54 149.87,41.08 138.97,30.19 C18.+ C14.+ 69.78,30.19 58.89,41.08 58.89,41.54 MOTOR_CTRL_3.6 58.2,40.4 56.45,38.64 49.67,38.64 43.95,44.36 43.19,44.36 34.05,53.5 34.05,58.23 R4.2 33.59,59.14 33.51,59.22 33.51,65.31 R2.2 33.13,66.3 33.13,68.74 25.82,76.06 25.82,91.76 30.01,95.95 C13.+ | C10.+ 164.42,85.81 168.01,82.23 168.01,81.85 MOTOR_CTRL_2.6 | C6.+ 45.55,85.89 41.97,82.31 41.97,81.85 MOTOR_CTRL_1.6 | C5.+ 30.08,113.7 30.08,96.94 C13.+ | C6.+ 44.64,92.59 33.59,92.59 30.85,95.34 C13.+ | C6.+ 45.55,100.04 v46.57,101.05
  Bottom 2.032: R3.2 175.47,71.87 178.67,75.07 178.67,81.77 175.7,84.74 | 175.7,84.74 170.52,84.74 168.08,82.31 168.08,81.85 MOTOR_CTRL_2.6 | 175.7,84.74 176.24,85.58 179.89,89.24 179.89,95.95 C17.+ 179.89,96.94 179.89,113.7 C9.+ | v46.57,101.05 51.65,106.13 J2.1
XTAL1
  Top 0.152: IC_1.7 102.93,83.68 102.93,84.29 102.55,84.67 82.36,84.67 82.13,84.44 Q1.2 82.13,84.52 77.1,84.52 C2.2
XTAL2
  Top 0.152: IC_1.8 102.17,83.6 86.09,83.6 82.13,79.64 Q1.1 82.13,79.56 82.05,79.49 77.1,79.49 C1.2

### Text on the board
tNames: Guardians Of The Galaxy